# EAGLE design AS5047P (EAGLE 9.5.1)
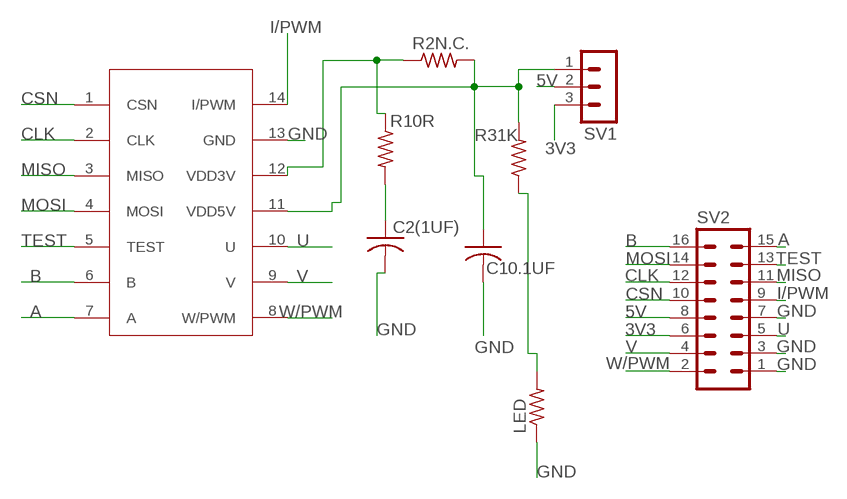
[diagram p0: schematic, sheet 1]

## Parts
C2(1UF)  C-USC1206  [C1206]
C10.1UF  C-USC1206  [C1206]
LED  R-US_R1206  [R1206]
R2N.C.  R-US_R1206  [R1206]
R10R  R-US_R1206  [R1206]
R31K  R-US_R1206  [R1206]
SV1  MA03-1  [MA03-1]
SV2  MA08-2  [MA08-2]
U$1  AS5047  [SOP65P640X110-14N]

## Nets
3V3: SV1.3 SV2.6
5V: SV1.2 SV2.8
A: SV2.15 U$1.7(A)
B: SV2.16 U$1.6(B)
CLK: SV2.12 U$1.2(CLK)
CSN: SV2.10 U$1.1(CSN)
GND: C2(1UF).2 C10.1UF.2 LED.1 SV2.1 SV2.3 SV2.7 U$1.13(GND)
I/PWM: SV2.9 U$1.14(I/PWM)
MISO: SV2.11 U$1.3(MISO)
MOSI: SV2.14 U$1.4(MOSI)
N$1: R2N.C..1 R10R.1 U$1.12(VDD3V)
N$2: LED.2 R31K.1
N$3: C2(1UF).1 R10R.2
N$4: C10.1UF.1 R2N.C..2 R31K.2 SV1.1 U$1.11(VDD5V)
TEST: SV2.13 U$1.5(TEST)
U: SV2.5 U$1.10(U)
V: SV2.4 U$1.9(V)
W/PWM: SV2.2 U$1.8(W/PWM)

## Library data of the parts
C2(1UF) C10.1UF = rcl:C-US: CAPACITOR, American symbol; SPICEPREFIX: C
LED R2N.C. R10R R31K = rcl:R-US_: RESISTOR, American symbol; SPICEPREFIX: R
SV1 = con-lstb:MA03-1: PIN HEADER; OC_FARNELL: unknown; OC_NEWARK: unknown
SV2 = con-lstb:MA08-2: PIN HEADER; OC_FARNELL: unknown; OC_NEWARK: unknown
U$1 = AS5047P:AS5047

## Board
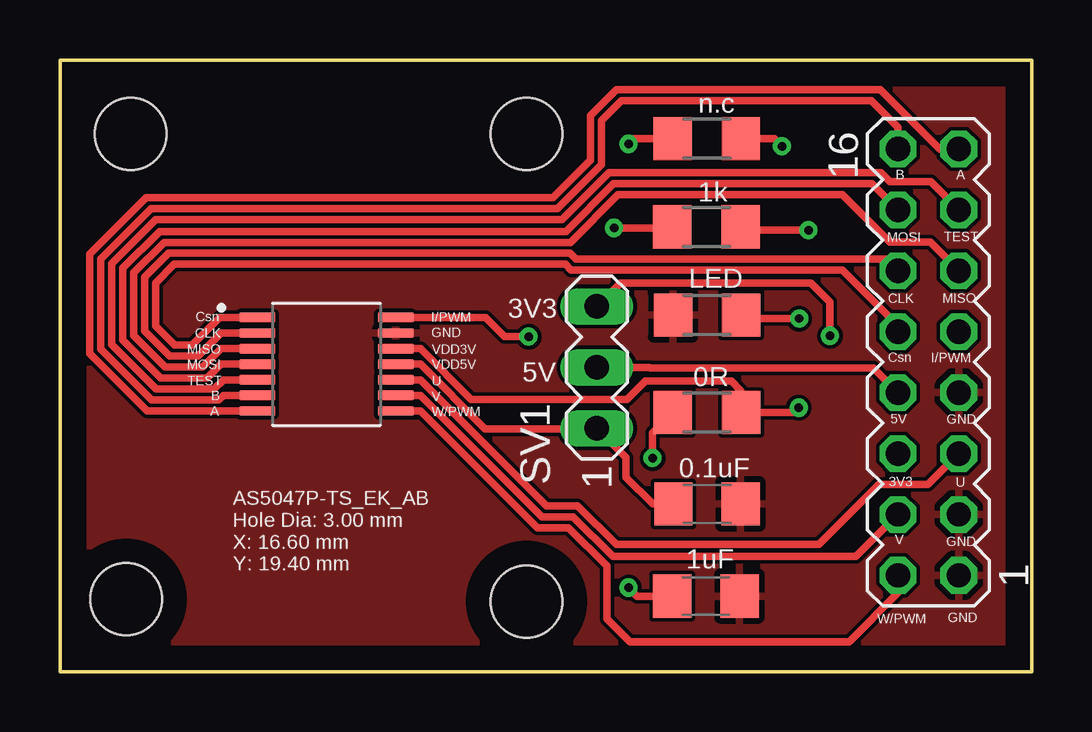
[diagram p1: board, top side]
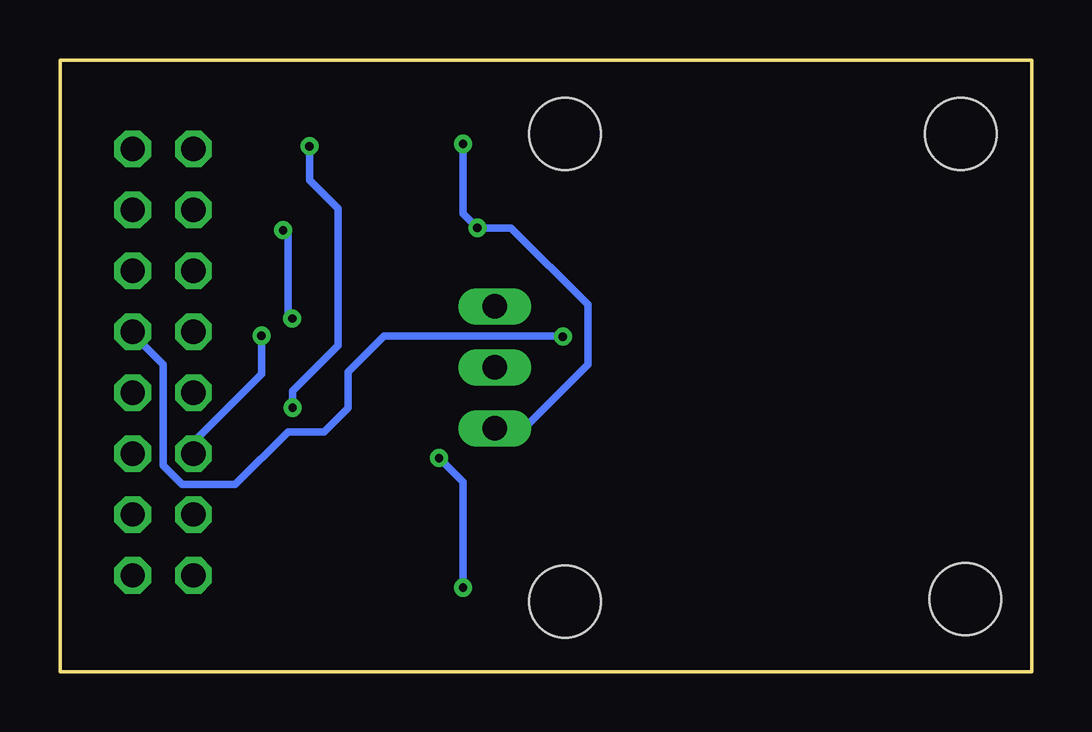
[diagram p2: board, bottom side, seen from below]

Size 40.5 x 25.5 mm. Coordinates in mm from the lower left corner, seen from the top.
Outline: 0,0 0,25.5 40.5,25.5 40.5,0 0,0
Copper layers (1*16): Top 0.035mm / dielectric 1.5mm / Bottom 0.035mm
Design rules "default": minimum track width 6mil, minimum drill 0.35mm, track to track 6mil, track to pad 6mil, pad to pad 6mil, via to via 6mil, smd to smd 6mil, copper to edge 40mil, drill to drill 6mil, minimum pad ring 10mil, minimum via ring 8mil, stop-mask expansion 4mil, vias tented up to drill 0mil, thermal gap 10mil
Holes 3 mm at 2.76,3.01 2.95,22.42 19.45,22.42 19.45,2.92

### Footprints (pad centres in the part's own frame; a part is rotated, then mirrored left to right if it is on the bottom)
C1206 = smd 1.6 x 1.8: 1 -1.4,0; 2 1.4,0
R1206 = smd 1.6 x 1.803: 1 -1.422,0; 2 1.422,0
MA03-1 = drill 1.016 long: 1 -2.54,0; 2 0,0; 3 2.54,0
MA08-2 = drill 1.016 octagon: 1 -8.89,-1.27; 2 -8.89,1.27; 3 -6.35,-1.27; 4 -6.35,1.27; 5 -3.81,-1.27; 6 -3.81,1.27; 7 -1.27,-1.27; 8 -1.27,1.27; 9 1.27,-1.27; 10 1.27,1.27; 11 3.81,-1.27; 12 3.81,1.27; 13 6.35,-1.27; 14 6.35,1.27; 15 8.89,-1.27; 16 8.89,1.27
SOP65P640X110-14N = smd 1.5 x 0.41: 1 -2.885,1.95; 2 -2.885,1.3; 3 -2.885,0.65; 4 -2.885,0; 5 -2.885,-0.65; 6 -2.885,-1.3; 7 -2.885,-1.95; 8 2.885,-1.95; 9 2.885,-1.3; 10 2.885,-0.65; 11 2.885,0; 12 2.885,0.65; 13 2.885,1.3; 14 2.885,1.95

### Placement (x,y rotation side)
C2(1UF)  26.93,3.14 0 top
C10.1UF  26.97,6.99 0 top
LED  26.98,14.86 0 top
R2N.C.  26.96,22.22 180 top
R10R  26.97,10.8 180 top
R31K  26.95,18.54 180 top
SV1  22.38,12.68 90 top
SV2  36.2,12.9 90 top
U$1  11.11,12.81 0 top

### Tracks (layer width: path | path; a pad name or v marks a point on that pad's centre or on a via)
3V3  (via drill 0.35)
  Top 0.305: SV1.3 23.36,16.2 31.3,16.2 32.1,15.4 v32.1,14
  Bottom 0.305: v32.1,14 32.1,12.4 34.93,9.57 SV2.6
5V
  Top 0.305: SV1.2 24.57,12.68 24.61,12.65 33.91,12.65 SV2.8
A
  Top 0.305: U$1.7 3.64,10.86 1.25,13.26 1.25,17.4 3.6,19.75 20.55,19.75 22.11,21.32 22.11,23.17 23.2,24.25 34.2,24.25 36.67,21.79 SV2.15
B
  Top 0.305: U$1.6 6.81,11.51 6.62,11.32 3.83,11.32 1.7,13.45 1.7,17.2 3.8,19.3 20.74,19.3 22.57,21.13 22.57,22.97 23.4,23.8 33.82,23.8 34.93,22.69 SV2.16
CLK
  Top 0.305: U$1.2 6.72,14.11 5.76,13.15 4.58,13.15 3.53,14.2 3.53,16.44 4.53,17.44 21.26,17.44 21.5,17.2 34.44,17.2 SV2.12
CSN
  Top 0.305: U$1.1 6.66,14.76 5.51,13.61 4.78,13.61 3.99,14.4 3.99,16.2 4.77,16.98 21.07,16.98 21.31,16.74 32.61,16.74 34.93,14.42 SV2.10
GND
  pour Top: -2.1,28.2 38.7,28.2 41.9,25 41.9,0.2 37.6,-4.1 -0.9,-4.1 -3.6,-1.4 -5.7,0.7 -5.7,25 -2.5,28.2
I/PWM  (via drill 0.35)
  Top 0.305: v19.54,13.96 18.54,13.96 17.74,14.76 U$1.14
  Bottom 0.305: v19.54,13.96 19.57,14 27,14 28.5,12.5 28.5,11 29.5,10 31,10 33.2,7.8 35.4,7.8 36.2,8.6 36.2,12.8 37.47,14.07 SV2.9
MISO
  Top 0.305: U$1.3 6.72,13.46 5.95,12.69 4.39,12.69 3.07,14.01 3.07,16.63 4.34,17.89 21.28,17.89 23.27,19.89 32.61,19.89 34.6,17.9 36.28,17.9 SV2.11
MOSI
  Top 0.305: U$1.4 6.71,12.81 6.13,12.23 4.2,12.23 2.62,13.82 2.62,16.82 4.15,18.35 21.09,18.35 23.08,20.34 33.84,20.34 SV2.14
N$1  (via drill 0.35)
  Top 0.305: U$1.12 15.02,13.46 17.14,11.34 23.64,11.34 24.4,12.1 28,12.1 28.39,11.71 R10R.1 30.6,10.8 v30.8,11 | v30.1,21.9 29.78,22.22 R2N.C..1
  Bottom 0.305: v30.8,11 30.8,11.7 28.9,13.6 28.9,19.3 30.1,20.5 v30.1,21.9
N$2  (via drill 0.35)
  Top 0.305: v30.82,14.72 28.55,14.72 LED.2 | v31.2,18.4 28.51,18.4 R31K.1
  Bottom 0.305: v30.82,14.72 31,14.9 31,18.2 v31.2,18.4
N$3  (via drill 0.35)
  Top 0.305: C2(1UF).1 24.05,3.15 v23.7,3.5 | v24.7,8.9 24.7,9.95 R10R.2
  Bottom 0.305: v23.7,3.5 23.7,7.9 v24.7,8.9
N$4  (via drill 0.35)
  Top 0.305: U$1.11 15.03,12.81 17.72,10.12 22.36,10.12 SV1.1 23.6,8.92 23.6,8.1 24.71,6.99 C10.1UF.1 | v23.1,18.5 25.49,18.5 R31K.2 | R2N.C..2 23.92,22.22 v23.7,22
  Bottom 0.305: SV1.1 21.16,10.14 18.5,12.8 18.5,15.3 21.7,18.5 v23.1,18.5 23.7,19.1 v23.7,22
TEST
  Top 0.305: U$1.5 6.82,12.16 6.43,11.78 4.01,11.78 2.16,13.63 2.16,17.01 3.99,18.84 20.93,18.84 22.89,20.8 34.21,20.8 34.59,20.42 36.3,20.42 SV2.13
U
  Top 0.305: U$1.10 15.03,12.16 20.28,6.91 21.58,6.91 23.2,5.3 31.63,5.3 34.13,7.8 36.18,7.8 SV2.5
V
  Top 0.305: U$1.9 15.03,11.51 20.09,6.46 21.39,6.46 23.05,4.8 33.18,4.8 SV2.4
W/PWM
  Top 0.305: U$1.8 15.04,10.86 19.9,6 21.2,6 22.8,4.4 22.8,2.2 23.75,1.25 32.9,1.25 34.93,3.27 SV2.2

### Text on the board
tPlace: Csn | I/PWM | 3V3 | CLK | GND | MOSI | MISO | VDD5V | VDD3V | TEST | U | 5V | A | B | W/PWM | V
tNames: n.c | B | A | 1k | MOSI | TEST | LED | CLK | MISO | Csn | I/PWM | 0R | 5V | GND | 0.1uF | 3V3 | U | V | GND | AS5047P-TS_EK_AB / Hole Dia: 3.00 mm / X: 16.60 mm / Y: 19.40 mm | 1uF | W/PWM | GND